# EasyEDA Pro project 光耦隔离继电器.eprj

# Schematic 版本一
Board Name: Board1; Create Date: 2026-01-29; Page Name: P1; Project Name: 光耦隔离继电器; Schematic Name: 版本一; Update Date: 2026-04-21; Company: 嘉立创EDA; Page Size: A4; Version: V1.0
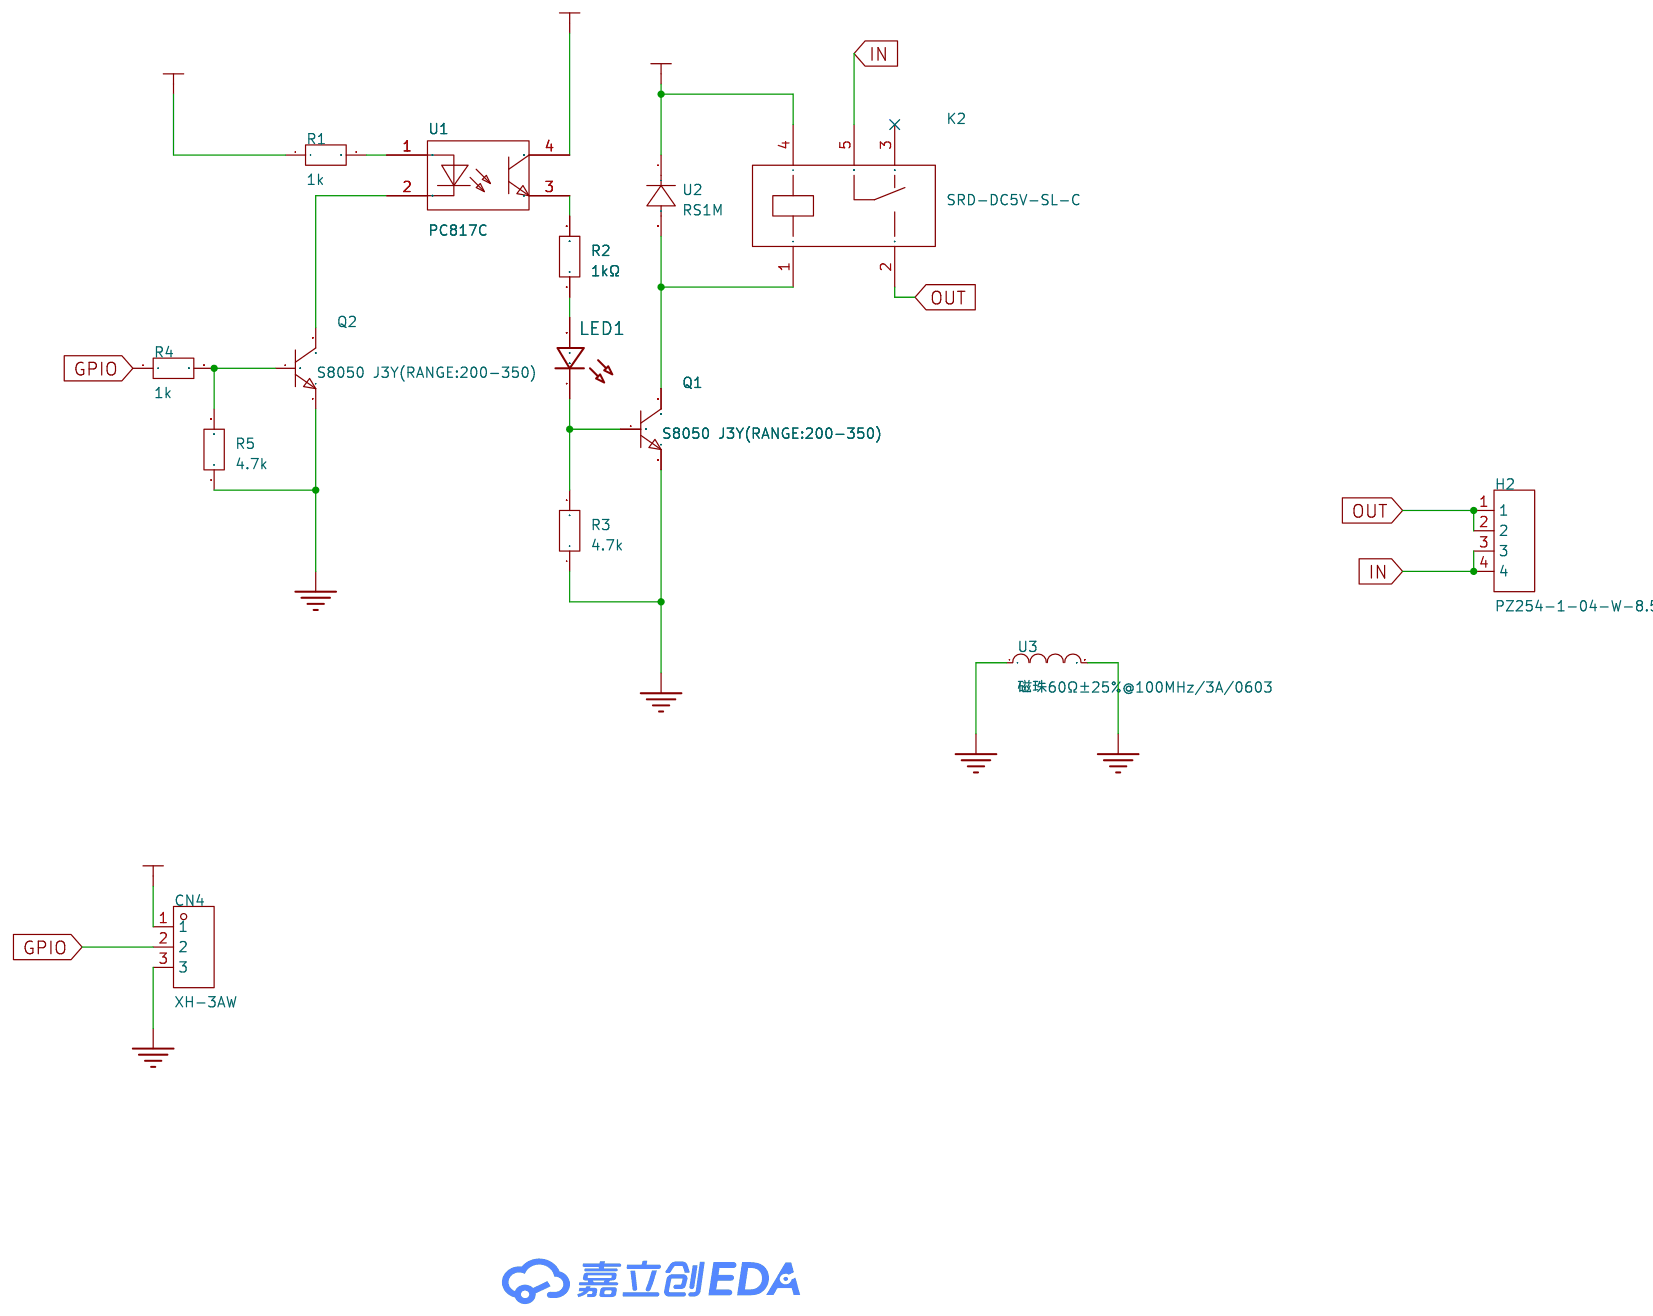
[diagram p0: schematic sheet]

## Parts
CN4  XH-3AW  [CONN-TH_3P-P2.54_HCTL_XH-3AW]
H2  PZ254-1-04-W-8.5  [HDR-TH_04P-P2.54-H-M-W10.4-N]
K2  SRD-DC5V-SL-C  [RELAY-TH_SRD-DCXXV-SL-C]
LED1  -  [LED_604]
Q1  S8050 J3Y(RANGE:200-350)  [SOT-23-3_L3.0-W1.7-P0.95-LS2.9-BR]
Q2  S8050 J3Y(RANGE:200-350)  [SOT-23-3_L3.0-W1.7-P0.95-LS2.9-BR]
R1  1k  [R0603]
R2  1kΩ  [R0603]
R3  4.7k  [R0603]
R4  1k  [R0603]
R5  4.7k  [R0603]
U1  PC817C  [SOP-4_L6.5-W4.6-P2.54-LS9.6-TL]
U2  RS1M  [SMA_L4.3-W2.6-LS5.1-RD]
U3  磁珠60Ω±25%@100MHz/3A/0603  [L0603]

## Library data of the parts
CN4 = XH-3AW_C2908612: LCSC Part Name: 1x3P 间距:2.54mm 弯插 系列:XH; Supplier Part: C2908612; Manufacturer: HCTL(华灿天禄); Supplier Footprint: 弯插,P=2.5mm; JLCPCB Part Class: 扩展库; Datasheet: https://item.szlcsc.com/datasheet/XH-3AW/3184383.html; Supplier: LCSC; Pins Structure: 1x3P; Pitch: 2.54mm; Mounting Type: 弯插; Reference Series: XH; Number of Pins: 3P; Number of Rows: 1; Number of PINs Per Row: 3; Current Rating: 3A; Contact Material: 黄铜; Contact Plating: 锡; Operating Temperature: -25℃~+85℃; Voltage Rating: 250V; Plastic Material: PA66; Flame Retardant Rating: UL94V-0; Z-Height of the Board: 5.9mm; Y-Width of Bottom Edge on Board: 7mm
H2 = PZ254-1-04-W-8.5: LCSC Part Name: 1x4P 间距:2.54mm 方针 弯插; Supplier Part: C2894946; Manufacturer: HCTL(华灿天禄); Supplier Footprint: 弯插,P=2.54mm; JLCPCB Part Class: 扩展库; Datasheet: https://item.szlcsc.com/datasheet/PZ254-1-04-W-8.5/3132622.html; Supplier: LCSC; Pin Structure: 1x4P; Pitch: 2.54mm; Circluar Pins/Square Pins: 方针; Mounting Type: 弯插; Number of Rows: 单排; Number of Pins: 4P; Current Rating: 3A; Length of Mating Pin: 6mm; Insulation Height: 2.5mm; Operating Temperature: -40℃~+105℃; Color: 黑色
K2 = SRD-DC5V-SL-C: Supplier Part: C688865; Supplier Footprint: 插件; JLCPCB Part Class: 扩展库; Supplier: LCSC
LED1 = LED_0603-R_1: Supplier Footprint: 0603
Q1 Q2 = S8050 J3Y(RANGE:200-350): LCSC Part Name: H档(200-350) NPN 电流:0.5A 电压:25V; Supplier Part: C2146; Manufacturer: CJ(江苏长电/长晶); Supplier Footprint: SOT-23; JLCPCB Part Class: 基础库; Datasheet: https://item.szlcsc.com/datasheet/S8050%2520J3Y(RANGE%253A200-350)/2503.html; Supplier: LCSC; type: NPN; Current - Collector(Ic): 500mA; Collector - Emitter Voltage VCEO: 25V; Pd - Power Dissipation: 300mW; DC Current Gain: 200@500mA,1V; Transition frequency(fT): 150MHz; Current - Collector Cutoff: 100nA; Vce Saturation(VCE(sat)): 600mV@500mA,50mA; Operating Temperature: -55℃~+150℃; Emitter-Base Voltage(Vebo): 5V; Number: 1个NPN
R1-R5 = TRR03EZPJ221: LCSC Part Name: 厚膜电阻 220Ω ±5% 100mW; Supplier Part: C7365471; Manufacturer: ROHM(罗姆); Supplier Footprint: 0603; JLCPCB Part Class: 扩展库; Datasheet: https://item.szlcsc.com/datasheet/TRR03EZPJ221/8336302.html; Supplier: LCSC; Type: 厚膜电阻; Tolerance: ±5%; Power(Watts): 100mW; Temperature Coefficient: ±200ppm/℃; Operating Temperature: -55℃~+155℃
U1 = PC817C: Supplier Part: C694856; Supplier Footprint: SOP-4-2.54mm; Supplier: LCSC
U2 = RS1M: Supplier Part: C9900004792; JLCPCB Part Class: 扩展库; Supplier: LCSC
U3 = 磁珠60Ω±25%@100MHz/3A/0603: Supplier Part: C9900021622; Supplier Footprint: 0603; JLCPCB Part Class: 扩展库; Supplier: LCSC

## Nets
+5V: CN4.1 K2.4 R1.1 U1.4(COL) U2.1(K)
GND: CN4.3 Q2.2(E) R5.1 U3.1
PGND: Q1.2(E) R3.1 U3.2
GPIO: CN4.2 R4.1
IN: H2.3 H2.4 K2.5
OUT: H2.1 H2.2 K2.2
$1N660: R2.2 U1.3(EM)
$1N856: K2.1 Q1.3(C) U2.2(A)
$1N1139: LED1.2(A) R2.1
$1N1143: LED1.1(C) Q1.1(B) R3.2
$1N3326: R1.2 U1.1(AN)
$1N3375: Q2.3(C) U1.2(CAT)
$1N3423: Q2.1(B) R4.2 R5.2

Not connected (* = marked no-connect by the designer): K2 3*

# Schematic 版本2
Board Name: Board2; Create Date: 2026-04-22; Page Name: P1; Project Name: 光耦隔离继电器; Schematic Name: 版本2; Update Date: 2026-04-22; Company: 嘉立创EDA; Page Size: A4; Version: V1.0
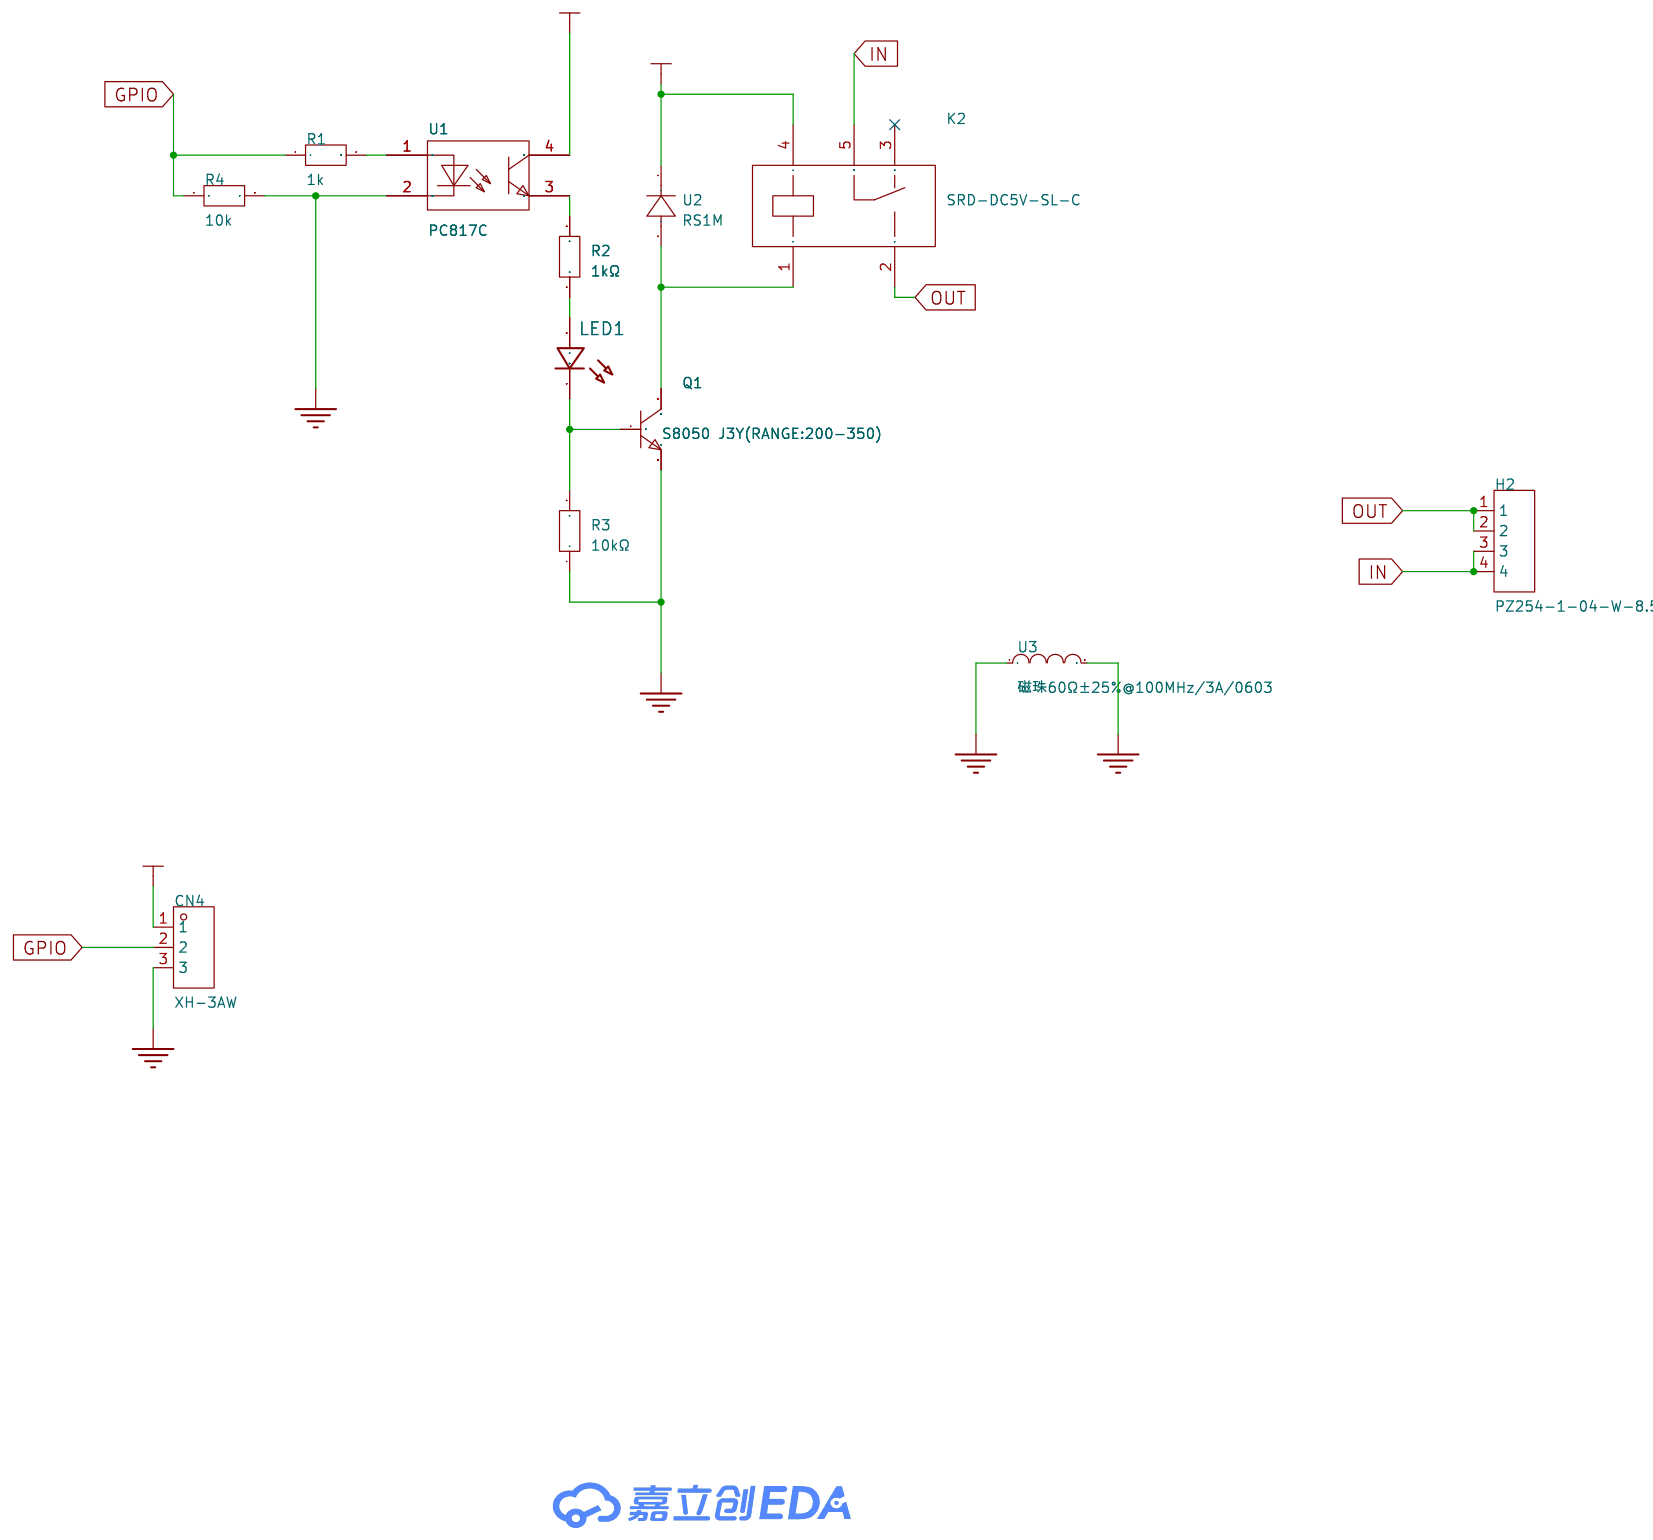
[diagram p1: schematic sheet]

## Parts
CN4  XH-3AW  [CONN-TH_3P-P2.54_HCTL_XH-3AW]
H2  PZ254-1-04-W-8.5  [HDR-TH_04P-P2.54-H-M-W10.4-N]
K2  SRD-DC5V-SL-C  [RELAY-TH_SRD-DCXXV-SL-C]
LED1  -  [LED_604]
Q1  S8050 J3Y(RANGE:200-350)  [SOT-23-3_L3.0-W1.7-P0.95-LS2.9-BR]
R1  1k  [R0603]
R2  1kΩ  [R0603]
R3  10kΩ  [R0603]
R4  10k  [R0603]
U1  PC817C  [SOP-4_L6.5-W4.6-P2.54-LS9.6-TL]
U2  RS1M  [SMA_L4.3-W2.6-LS5.1-RD]
U3  磁珠60Ω±25%@100MHz/3A/0603  [L0603]

## Library data of the parts
CN4 = XH-3AW_C2908612: LCSC Part Name: 1x3P 间距:2.54mm 弯插 系列:XH; Supplier Part: C2908612; Manufacturer: HCTL(华灿天禄); Supplier Footprint: 弯插,P=2.5mm; JLCPCB Part Class: 扩展库; Datasheet: https://item.szlcsc.com/datasheet/XH-3AW/3184383.html; Supplier: LCSC; Pins Structure: 1x3P; Pitch: 2.54mm; Mounting Type: 弯插; Reference Series: XH; Number of Pins: 3P; Number of Rows: 1; Number of PINs Per Row: 3; Current Rating: 3A; Contact Material: 黄铜; Contact Plating: 锡; Operating Temperature: -25℃~+85℃; Voltage Rating: 250V; Plastic Material: PA66; Flame Retardant Rating: UL94V-0; Z-Height of the Board: 5.9mm; Y-Width of Bottom Edge on Board: 7mm
H2 = PZ254-1-04-W-8.5: LCSC Part Name: 1x4P 间距:2.54mm 方针 弯插; Supplier Part: C2894946; Manufacturer: HCTL(华灿天禄); Supplier Footprint: 弯插,P=2.54mm; JLCPCB Part Class: 扩展库; Datasheet: https://item.szlcsc.com/datasheet/PZ254-1-04-W-8.5/3132622.html; Supplier: LCSC; Pin Structure: 1x4P; Pitch: 2.54mm; Circluar Pins/Square Pins: 方针; Mounting Type: 弯插; Number of Rows: 单排; Number of Pins: 4P; Current Rating: 3A; Length of Mating Pin: 6mm; Insulation Height: 2.5mm; Operating Temperature: -40℃~+105℃; Color: 黑色
K2 = SRD-DC5V-SL-C: Supplier Part: C688865; Supplier Footprint: 插件; JLCPCB Part Class: 扩展库; Supplier: LCSC
LED1 = LED_0603-R_1: Supplier Footprint: 0603
Q1 = S8050 J3Y(RANGE:200-350): LCSC Part Name: H档(200-350) NPN 电流:0.5A 电压:25V; Supplier Part: C2146; Manufacturer: CJ(江苏长电/长晶); Supplier Footprint: SOT-23; JLCPCB Part Class: 基础库; Datasheet: https://item.szlcsc.com/datasheet/S8050%2520J3Y(RANGE%253A200-350)/2503.html; Supplier: LCSC; type: NPN; Current - Collector(Ic): 500mA; Collector - Emitter Voltage VCEO: 25V; Pd - Power Dissipation: 300mW; DC Current Gain: 200@500mA,1V; Transition frequency(fT): 150MHz; Current - Collector Cutoff: 100nA; Vce Saturation(VCE(sat)): 600mV@500mA,50mA; Operating Temperature: -55℃~+150℃; Emitter-Base Voltage(Vebo): 5V; Number: 1个NPN
R1-R4 = TRR03EZPJ221: LCSC Part Name: 厚膜电阻 220Ω ±5% 100mW; Supplier Part: C7365471; Manufacturer: ROHM(罗姆); Supplier Footprint: 0603; JLCPCB Part Class: 扩展库; Datasheet: https://item.szlcsc.com/datasheet/TRR03EZPJ221/8336302.html; Supplier: LCSC; Type: 厚膜电阻; Tolerance: ±5%; Power(Watts): 100mW; Temperature Coefficient: ±200ppm/℃; Operating Temperature: -55℃~+155℃
U1 = PC817C: Supplier Part: C694856; Supplier Footprint: SOP-4-2.54mm; Supplier: LCSC
U2 = RS1M: Supplier Part: C9900004792; JLCPCB Part Class: 扩展库; Supplier: LCSC
U3 = 磁珠60Ω±25%@100MHz/3A/0603: Supplier Part: C9900021622; Supplier Footprint: 0603; JLCPCB Part Class: 扩展库; Supplier: LCSC

## Nets
+5V: CN4.1 K2.4 U1.4(COL) U2.1(K)
GND: CN4.3 R4.2 U1.2(CAT) U3.1
PGND: Q1.2(E) R3.1 U3.2
GPIO: CN4.2 R1.1 R4.1
IN: H2.3 H2.4 K2.5
OUT: H2.1 H2.2 K2.2
$1N786: R2.2 U1.3(EM)
$1N787: K2.1 Q1.3(C) U2.2(A)
$1N790: LED1.2(A) R2.1
$1N791: LED1.1(C) Q1.1(B) R3.2
$1N802: R1.2 U1.1(AN)

Not connected (* = marked no-connect by the designer): K2 3*

# Board PCB1
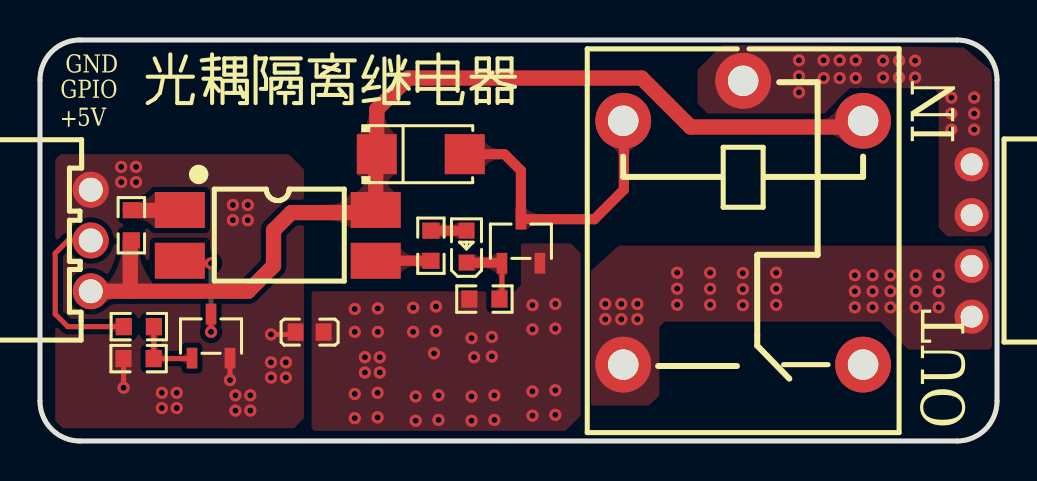
[diagram p2: board, top side]
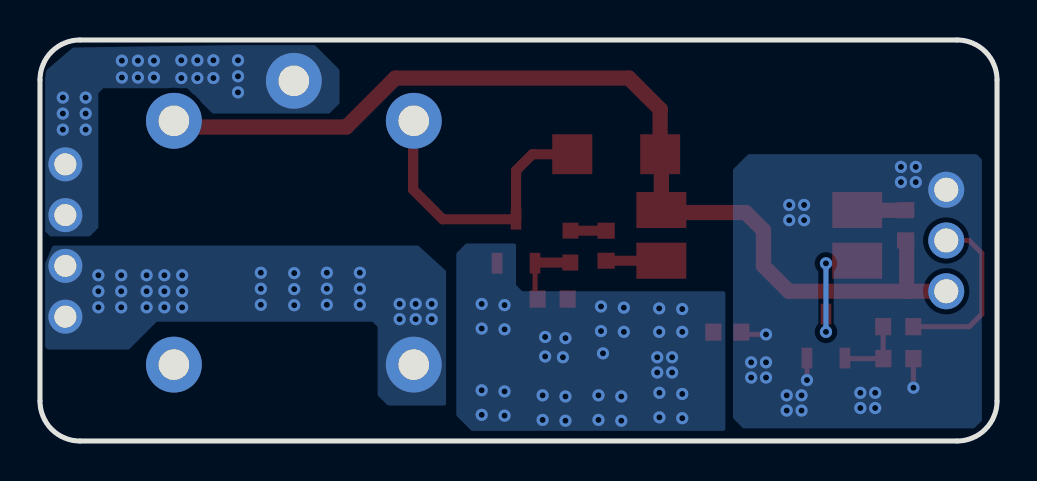
[diagram p3: board, bottom side, seen from below]

Outline 47.88 x 20.07 mm; copper layers: Top Layer, Bottom Layer. Coordinates in mm from the lower left corner of the outline.
Outline path: 0,18.07 0,2 arc(0.59,0.59) 2,0 45.88,0 arc(47.29,0.59) 47.88,2 47.88,18.07 arc(47.29,19.48) 45.88,20.07 2,20.07 arc(0.59,19.48) 0,18.07
Stack: Top Layer 0.035mm / Dielectric1 1.51mm FR4 er 4.5 / Bottom Layer 0.035mm

## Design rules (mm)
template: 自定义配置
spacing copperThickness1oz (default): track to track 0.102, other pairs 0.152 to 0.3
spacing copperThickness2oz: track to track 0.203, other pairs 0.152 to 0.3
track width copperThickness1oz (default): min 0.127, default 0.254, max 2.54
track width copperThickness2oz: min 0.203, default 0.254, max 2.54
differential pair differentialPair (default): width min 0.127, default 0.254, max 2.54; gap min 0.152, default 0.152
via viaSize (default): diameter min 0.5, default 0.61, max 10; hole min 0.3, default 0.305, max 6.3

## Placement (name value [footprint] x y rotation side)
CN4  XH-3AW  [CONN-TH_3P-P2.54_HCTL_XH-3AW]  2.54 10.03 90 top
H2  PZ254-1-04-W-8.5  [HDR-TH_04P-P2.54-H-M-W10.4-N]  46.61 10.03 90 top
K2  SRD-DC5V-SL-C  [RELAY-TH_SRD-DCXXV-SL-C]  35.18 10.92 270 top
LED1  -  [LED_604]  21.34 9.78 90 top
Q1  S8050 J3Y(RANGE:200-350)  [SOT-23-3_L3.0-W1.7-P0.95-LS2.9-BR]  24.06 10 270 top
Q2  S8050 J3Y(RANGE:200-350)  [SOT-23-3_L3.0-W1.7-P0.95-LS2.9-BR]  8.56 5.25 270 top
R1  1k  [R0603]  4.57 10.8 90 top
R2  1kΩ  [R0603]  19.56 9.77 270 top
R3  4.7k  [R0603]  22.23 7.1 0 top
R4  1k  [R0603]  4.94 5.72 0 top
R5  4.7k  [R0603]  4.93 4.12 0 top
U1  PC817C  [SOP-4_L6.5-W4.6-P2.54-LS9.6-TL]  11.9 10.29 0 top
U2  RS1M  [SMA_L4.3-W2.6-LS5.1-RD]  19.05 14.35 0 top
U3  磁珠60Ω±25%@100MHz/3A/0603  [L0603]  13.49 5.45 0 top

## Footprints (pads in the part's own frame, mm; a bottom-side part is the same pattern mirrored in y, then rotated)
CONN-TH_3P-P2.54_HCTL_XH-3AW
  round 1.8 hole 1.199: 1(-2.54,0) 2(0.002,0) 3(2.54,0)
HDR-TH_04P-P2.54-H-M-W10.4-N
  round 1.7 hole 1.1: 1(-3.81,0) 2(-1.27,0) 3(1.27,0) 4(3.81,0)
L0603
  rect 0.8x0.864 smd: 1(-0.7,0) 2(0.7,0)
LED_604
  rect 0.8x0.8 smd: 1(-0.851,-0.01) 2(0.75,-0.005)
R0603
  rect 0.806x0.864 smd: 1(-0.753,0) 2(0.753,0)
RELAY-TH_SRD-DCXXV-SL-C
  round 2.794 hole 1.524: 1(-5.1,-6) 2(7.1,-6) 3(7.1,6) 4(-5.1,6) 5(-7.1,0)
SMA_L4.3-W2.6-LS5.1-RD
  rect 2x2 smd: 1(-2.2,0) 2(2.2,0)
SOP-4_L6.5-W4.6-P2.54-LS9.6-TL
  rect 2.5x1.8 smd: 1(-4.9,1.27) 2(-4.9,-1.27) 3(4.9,-1.27) 4(4.9,1.27)
SOT-23-3_L3.0-W1.7-P0.95-LS2.9-BR
  rect 1.038x0.532 smd: 1(1.101,-0.95) 2(1.101,0.95) 3(-1.101,0)

## Nets
As in the schematic.

Pads without a net: K2 3

## Via types
v1: diameter 0.61, hole 0.305, Top Layer to Bottom Layer, 116 vias

## Routing (per net, layer and track width the routed paths; a pad name or vN(x,y) marks a point on that pad's centre or on a via; arc(x,y) is an arc through that point)
+5V: length 50.7
  Top Layer w0.762: 4.45,7.49 4.52,7.56 4.52,10.03 ; 4.45,7.49 10.41,7.49 11.68,8.76 11.68,10.54 12.57,11.43 16.54,11.43 16.67,11.56 U1.4 16.8,14.3 U2.1 16.85,16.6 18.41,18.16 30.1,18.16 32.55,15.71 40.87,15.71 K2.4 ; 4.45,7.49 2.54,7.49
GND: length 3.8
  Top Layer w0.254: v1(11.56,5.33) 12.68,5.33 U3.1 ; R5.1 v1(4.18,2.67) ; Q2.2 v1(9.51,3.05)
  vias: v1(4.06,13.72) v1(4.06,12.95) v1(4.81,13.72) v1(4.81,12.95) v1(6.1,2.41) v1(6.1,1.65) v1(6.84,2.41) v1(6.84,1.65) v1(9.65,11.81) v1(9.65,11.05) v1(9.78,2.29) v1(9.78,1.52) v1(10.4,11.81) v1(10.4,11.05) v1(10.52,2.29) v1(10.52,1.52) v1(11.56,3.94) v1(11.56,3.17) v1(12.3,3.94) v1(12.3,3.17)
PGND:
  vias: v1(15.75,6.6) v1(15.75,5.46) v1(15.75,2.36) v1(15.75,1.14) v1(16.26,4.19) v1(16.26,3.43) v1(16.9,6.64) v1(16.9,5.46) v1(16.89,2.41) v1(16.89,1.18) v1(17,4.19) v1(17,3.43) v1(18.67,6.67) v1(18.67,5.46) v1(18.8,2.23) v1(18.8,1.02) v1(19.71,4.39) v1(19.81,6.73) v1(19.81,5.5) v1(19.94,2.29) v1(19.94,1.06) v1(21.59,5.15) v1(21.59,2.23) v1(21.59,1.02) v1(21.72,4.19) v1(22.61,5.21) v1(22.61,4.23) v1(22.73,2.29) v1(22.73,1.06) v1(24.64,6.8) v1(24.64,5.59) v1(24.64,2.48) v1(24.64,1.27) v1(25.78,6.86) v1(25.78,5.63) v1(25.78,2.54) v1(25.78,1.31)
GPIO: length 8.8
  Top Layer w0.254: R4.1 1.39,5.72 0.76,6.35 0.76,9.4 1.4,10.03 CN4.2
IN:
  vias: v1(37.97,19.05) v1(37.97,18.25) v1(37.97,17.45) v1(39.2,19.05) v1(39.2,18.16) v1(40,19.05) v1(40,18.16) v1(40.81,19.05) v1(40.81,18.16) v1(42.18,19.03) v1(42.18,18.19) v1(42.98,19.03) v1(42.98,18.19) v1(43.78,19.03) v1(43.78,18.19) v1(45.59,17.18) v1(45.59,16.38) v1(45.59,15.58) v1(46.74,17.18) v1(46.74,16.38) v1(46.74,15.58)
OUT:
  vias: v1(28.28,6.86) v1(28.28,6.1) v1(29.08,6.86) v1(29.08,6.1) v1(29.89,6.86) v1(29.89,6.1) v1(31.88,8.42) v1(31.88,7.62) v1(31.88,6.82) v1(33.53,8.42) v1(33.53,7.62) v1(33.53,6.82) v1(35.16,8.4) v1(35.16,7.6) v1(35.16,6.8) v1(36.83,8.42) v1(36.83,7.62) v1(36.83,6.82) v1(40.77,8.29) v1(40.77,7.49) v1(40.77,6.69) v1(41.66,8.29) v1(41.66,7.49) v1(41.66,6.69) v1(42.55,8.29) v1(42.55,7.49) v1(42.55,6.69) v1(43.81,8.29) v1(43.81,7.49) v1(43.81,6.69) v1(44.96,8.29) v1(44.96,7.49) v1(44.96,6.69)
$1N660: length 2.8
  Top Layer w0.508: 19.56,8.9 19.44,9.02 U1.3
$1N856: length 14.8
  Top Layer w0.508: U2.2 23.24,14.35 24.06,13.53 Q1.3 27.74,11.1 29.21,12.57 29.21,15.99 K2.1
$1N1139: length 1.8
  Top Layer w0.508: LED1.2 21.34,10.53 R2.1
$1N1143: length 3.6
  Top Layer w0.254: Q1.1 23.11,7.23 R3.2
  Top Layer w0.508: Q1.1 23.08,8.93 LED1.1
$1N3326: length 2.5
  Top Layer w0.762: U1.1 6.98,11.54 4.52,11.54
$1N3375: length 5.9
  Top Layer w0.254: U1.2 7.12,8.89 v1(8.56,8.89) ; Q2.3 v1(8.56,5.46)
  Bottom Layer w0.254: v1(8.56,5.46) v1(8.56,8.89)
$1N3423: length 3.5
  Top Layer w0.254: Q2.1 7.58,4.12 R5.2 5.7,4.13 5.7,5.72

## Copper pours and planes (outline as drawn; the poured copper is in the pictures)
GND on Top Layer: 1.02,14.35 12.45,14.35 13.21,13.59 13.21,1.14 12.7,0.64 1.14,0.64 0.76,1.02 0.76,14.09
GND on Bottom Layer: 1.02,14.35 12.45,14.35 13.21,13.59 13.21,1.14 12.7,0.64 1.14,0.64 0.76,1.02 0.76,14.09
PGND on Top Layer: 24.06,9.88 26.57,9.88 27.05,9.4 27.05,1.27 26.29,0.51 13.72,0.51 13.59,0.64 13.59,7.49 23.75,7.49 24.06,7.8
PGND on Bottom Layer: 24.06,9.88 26.57,9.88 27.05,9.4 27.05,1.27 26.29,0.51 13.59,0.51 13.59,7.49 23.75,7.49 24.06,7.8
IN on Top Layer: 32.89,16.89 32.89,18.58 34.19,19.88 46.23,19.69 47.62,18.49 47.62,10.49 47.37,10.24 45.39,10.24 44.96,10.67 44.96,17.4 44.7,17.65 40.51,17.65 39.24,16.38 33.4,16.38
IN on Bottom Layer: 32.89,16.89 32.89,18.58 34.19,19.88 46.23,19.69 47.62,18.49 47.62,10.49 47.37,10.24 45.39,10.24 44.96,10.67 44.96,17.4 44.7,17.65 40.51,17.65 39.24,16.38 33.4,16.38
OUT on Top Layer: 27.94,1.78 30.48,1.78 30.99,2.29 30.99,5.72 31.24,5.97 42.04,5.97 43.43,4.57 47.5,4.57 47.62,4.7 47.62,8.89 47.24,9.78 28.95,9.78 27.56,8.51 27.56,1.78 27.94,1.78
OUT on Bottom Layer: 27.94,1.78 30.48,1.78 30.99,2.29 30.99,5.72 31.24,5.97 42.04,5.97 43.43,4.57 47.5,4.57 47.62,4.7 47.62,8.89 47.24,9.78 28.95,9.78 27.56,8.51 27.56,1.78 27.94,1.78

Small or netless copper shapes (teardrops, artwork), in the pictures only: 32 on Top Layer, 2 on Bottom Layer

## Text on the board
Top Silkscreen Layer: GPIO | +5V | GND | 光耦隔离继电器 | IN | OUT

# Board PCB2
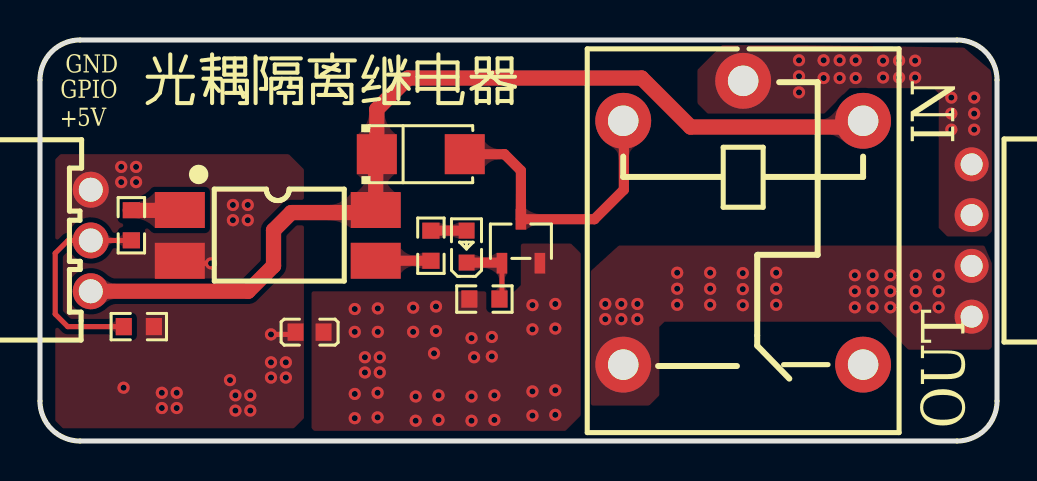
[diagram p4: board, top side]
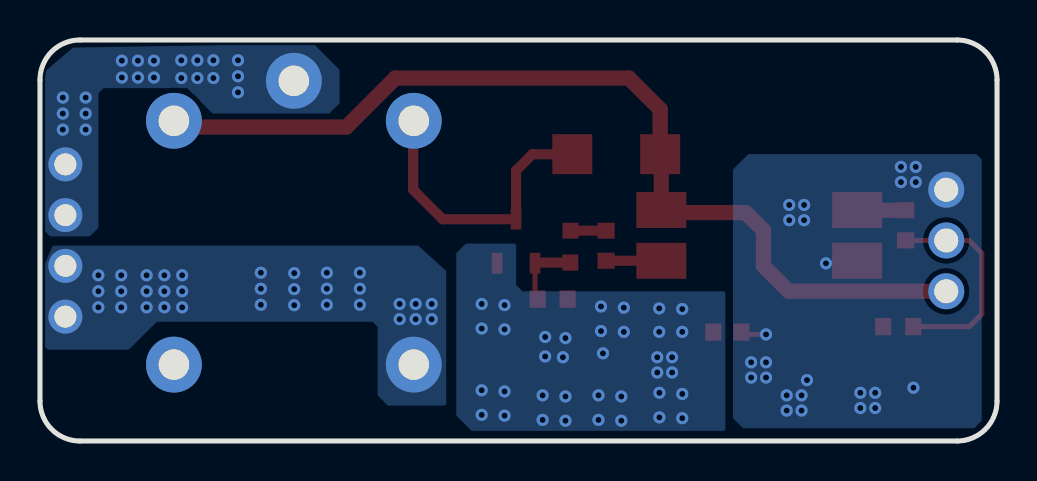
[diagram p5: board, bottom side, seen from below]

Outline 47.88 x 20.07 mm; copper layers: Top Layer, Bottom Layer. Coordinates in mm from the lower left corner of the outline.
Outline path: 0,18.07 0,2 arc(0.59,0.59) 2,0 45.88,0 arc(47.29,0.59) 47.88,2 47.88,18.07 arc(47.29,19.48) 45.88,20.07 2,20.07 arc(0.59,19.48) 0,18.07
Stack: Top Layer 0.035mm / Dielectric1 1.51mm FR4 er 4.5 / Bottom Layer 0.035mm

## Design rules (mm)
template: 自定义配置
spacing copperThickness1oz (default): track to track 0.102, other pairs 0.152 to 0.3
spacing copperThickness2oz: track to track 0.203, other pairs 0.152 to 0.3
track width copperThickness1oz (default): min 0.127, default 0.254, max 2.54
track width copperThickness2oz: min 0.203, default 0.254, max 2.54
differential pair differentialPair (default): width min 0.127, default 0.254, max 2.54; gap min 0.152, default 0.152
via viaSize (default): diameter min 0.5, default 0.61, max 10; hole min 0.3, default 0.305, max 6.3

## Placement (name value [footprint] x y rotation side)
CN4  XH-3AW  [CONN-TH_3P-P2.54_HCTL_XH-3AW]  2.54 10.03 90 top
H2  PZ254-1-04-W-8.5  [HDR-TH_04P-P2.54-H-M-W10.4-N]  46.61 10.03 90 top
K2  SRD-DC5V-SL-C  [RELAY-TH_SRD-DCXXV-SL-C]  35.18 10.92 270 top
LED1  -  [LED_604]  21.34 9.78 90 top
Q1  S8050 J3Y(RANGE:200-350)  [SOT-23-3_L3.0-W1.7-P0.95-LS2.9-BR]  24.06 10 270 top
R1  1k  [R0603]  4.57 10.8 90 top
R2  1kΩ  [R0603]  19.56 9.77 270 top
R3  10kΩ  [R0603]  22.23 7.1 0 top
R4  10k  [R0603]  4.94 5.72 0 top
U1  PC817C  [SOP-4_L6.5-W4.6-P2.54-LS9.6-TL]  11.9 10.29 0 top
U2  RS1M  [SMA_L4.3-W2.6-LS5.1-RD]  19.05 14.35 0 top
U3  磁珠60Ω±25%@100MHz/3A/0603  [L0603]  13.49 5.45 0 top

## Footprints (pads in the part's own frame, mm; a bottom-side part is the same pattern mirrored in y, then rotated)
CONN-TH_3P-P2.54_HCTL_XH-3AW
  round 1.8 hole 1.199: 1(-2.54,0) 2(0.002,0) 3(2.54,0)
HDR-TH_04P-P2.54-H-M-W10.4-N
  round 1.7 hole 1.1: 1(-3.81,0) 2(-1.27,0) 3(1.27,0) 4(3.81,0)
L0603
  rect 0.8x0.864 smd: 1(-0.7,0) 2(0.7,0)
LED_604
  rect 0.8x0.8 smd: 1(-0.851,-0.01) 2(0.75,-0.005)
R0603
  rect 0.806x0.864 smd: 1(-0.753,0) 2(0.753,0)
RELAY-TH_SRD-DCXXV-SL-C
  round 2.794 hole 1.524: 1(-5.1,-6) 2(7.1,-6) 3(7.1,6) 4(-5.1,6) 5(-7.1,0)
SMA_L4.3-W2.6-LS5.1-RD
  rect 2x2 smd: 1(-2.2,0) 2(2.2,0)
SOP-4_L6.5-W4.6-P2.54-LS9.6-TL
  rect 2.5x1.8 smd: 1(-4.9,1.27) 2(-4.9,-1.27) 3(4.9,-1.27) 4(4.9,1.27)
SOT-23-3_L3.0-W1.7-P0.95-LS2.9-BR
  rect 1.038x0.532 smd: 1(1.101,-0.95) 2(1.101,0.95) 3(-1.101,0)

## Nets
As in the schematic.

Pads without a net: K2 3

## Via types
v1: diameter 0.61, hole 0.305, Top Layer to Bottom Layer, 115 vias

## Routing (per net, layer and track width the routed paths; a pad name or vN(x,y) marks a point on that pad's centre or on a via; arc(x,y) is an arc through that point)
+5V: length 48.2
  Top Layer w0.762: K2.4 40.87,15.71 32.55,15.71 30.1,18.16 18.41,18.16 16.85,16.6 U2.1 16.8,14.3 U1.4 16.67,11.56 16.54,11.43 12.57,11.43 11.68,10.54 11.68,8.76 10.41,7.49 2.54,7.49
GND: length 2.9
  Top Layer w0.254: U3.1 12.68,5.33 v1(11.56,5.33) ; U1.2 7.12,8.89 v1(8.56,8.89)
  vias: v1(4.06,13.72) v1(4.06,12.95) v1(4.18,2.67) v1(4.81,13.72) v1(4.81,12.95) v1(6.1,2.41) v1(6.1,1.65) v1(6.84,2.41) v1(6.84,1.65) v1(9.51,3.05) v1(9.65,11.81) v1(9.65,11.05) v1(9.78,2.29) v1(9.78,1.52) v1(10.4,11.81) v1(10.4,11.05) v1(10.52,2.29) v1(10.52,1.52) v1(11.56,3.94) v1(11.56,3.18) v1(12.3,3.94) v1(12.3,3.18)
PGND:
  vias: v1(15.75,6.6) v1(15.75,5.46) v1(15.75,2.36) v1(15.75,1.14) v1(16.26,4.19) v1(16.26,3.43) v1(16.89,2.41) v1(16.89,1.18) v1(16.9,6.64) v1(16.9,5.46) v1(17,4.19) v1(17,3.43) v1(18.67,6.67) v1(18.67,5.46) v1(18.8,2.23) v1(18.8,1.02) v1(19.71,4.39) v1(19.81,6.73) v1(19.81,5.5) v1(19.94,2.29) v1(19.94,1.06) v1(21.59,5.15) v1(21.59,2.23) v1(21.59,1.02) v1(21.72,4.19) v1(22.61,5.21) v1(22.61,4.23) v1(22.73,2.29) v1(22.73,1.06) v1(24.64,6.8) v1(24.64,5.59) v1(24.64,2.48) v1(24.64,1.27) v1(25.78,6.86) v1(25.78,5.63) v1(25.78,2.54) v1(25.78,1.31)
GPIO: length 10.8
  Top Layer w0.254: 4.19,5.72 1.39,5.72 0.76,6.35 0.76,9.4 1.4,10.03 CN4.2 4.56,10.03 R1.1
IN:
  vias: v1(37.97,19.05) v1(37.97,18.25) v1(37.97,17.45) v1(39.2,19.05) v1(39.2,18.16) v1(40,19.05) v1(40,18.16) v1(40.81,19.05) v1(40.81,18.16) v1(42.18,19.03) v1(42.18,18.19) v1(42.98,19.03) v1(42.98,18.19) v1(43.78,19.03) v1(43.78,18.19) v1(45.59,17.18) v1(45.59,16.38) v1(45.59,15.58) v1(46.74,17.18) v1(46.74,16.38) v1(46.74,15.58)
OUT:
  vias: v1(28.28,6.86) v1(28.28,6.1) v1(29.08,6.86) v1(29.08,6.1) v1(29.89,6.86) v1(29.89,6.1) v1(31.88,8.42) v1(31.88,7.62) v1(31.88,6.82) v1(33.53,8.42) v1(33.53,7.62) v1(33.53,6.82) v1(35.16,8.4) v1(35.16,7.6) v1(35.16,6.8) v1(36.83,8.42) v1(36.83,7.62) v1(36.83,6.82) v1(40.77,8.29) v1(40.77,7.49) v1(40.77,6.69) v1(41.66,8.29) v1(41.66,7.49) v1(41.66,6.69) v1(42.54,8.29) v1(42.54,7.49) v1(42.54,6.69) v1(43.81,8.29) v1(43.81,7.49) v1(43.81,6.69) v1(44.96,8.29) v1(44.96,7.49) v1(44.96,6.69)
$1N786: length 2.8
  Top Layer w0.508: 19.56,8.9 19.44,9.02 U1.3
$1N787: length 14.8
  Top Layer w0.508: K2.1 29.21,15.99 29.21,12.57 27.73,11.1 Q1.3 24.06,13.53 23.24,14.35 U2.2
$1N790: length 1.8
  Top Layer w0.508: R2.1 21.34,10.53 LED1.2
$1N791: length 3.6
  Top Layer w0.254: R3.2 23.11,7.23 Q1.1
  Top Layer w0.508: LED1.1 23.08,8.93 Q1.1
$1N802: length 2.5
  Top Layer w0.762: U1.1 6.98,11.54 4.52,11.54

## Copper pours and planes (outline as drawn; the poured copper is in the pictures)
GND on Top Layer: 1.02,14.35 12.45,14.35 13.21,13.59 13.21,1.14 12.7,0.64 1.14,0.64 0.76,1.02 0.76,14.09
GND on Bottom Layer: 1.02,14.35 12.45,14.35 13.21,13.59 13.21,1.14 12.7,0.64 1.14,0.64 0.76,1.02 0.76,14.09
PGND on Top Layer: 24.06,9.88 26.57,9.88 27.05,9.4 27.05,1.27 26.29,0.51 13.72,0.51 13.59,0.64 13.59,7.49 23.75,7.49 24.06,7.8
PGND on Bottom Layer: 24.06,9.88 26.57,9.88 27.05,9.4 27.05,1.27 26.29,0.51 13.59,0.51 13.59,7.49 23.75,7.49 24.06,7.8
IN on Top Layer: 32.89,16.89 32.89,18.58 34.19,19.88 46.23,19.69 47.62,18.49 47.62,10.49 47.37,10.24 45.39,10.24 44.96,10.67 44.96,17.4 44.7,17.65 40.51,17.65 39.24,16.38 33.4,16.38
IN on Bottom Layer: 32.89,16.89 32.89,18.58 34.19,19.88 46.23,19.69 47.62,18.49 47.62,10.49 47.37,10.24 45.39,10.24 44.96,10.67 44.96,17.4 44.7,17.65 40.51,17.65 39.24,16.38 33.4,16.38
OUT on Top Layer: 27.94,1.78 30.48,1.78 30.99,2.29 30.99,5.72 31.24,5.97 42.04,5.97 43.43,4.57 47.5,4.57 47.62,4.7 47.62,8.89 47.24,9.78 28.95,9.78 27.56,8.51 27.56,1.78 27.94,1.78
OUT on Bottom Layer: 27.94,1.78 30.48,1.78 30.99,2.29 30.99,5.72 31.24,5.97 42.04,5.97 43.43,4.57 47.5,4.57 47.62,4.7 47.62,8.89 47.24,9.78 28.95,9.78 27.56,8.51 27.56,1.78 27.94,1.78

Small or netless copper shapes (teardrops, artwork), in the pictures only: 28 on Top Layer

## Text on the board
Top Silkscreen Layer: GPIO | +5V | GND | 光耦隔离继电器 | IN | OUT
